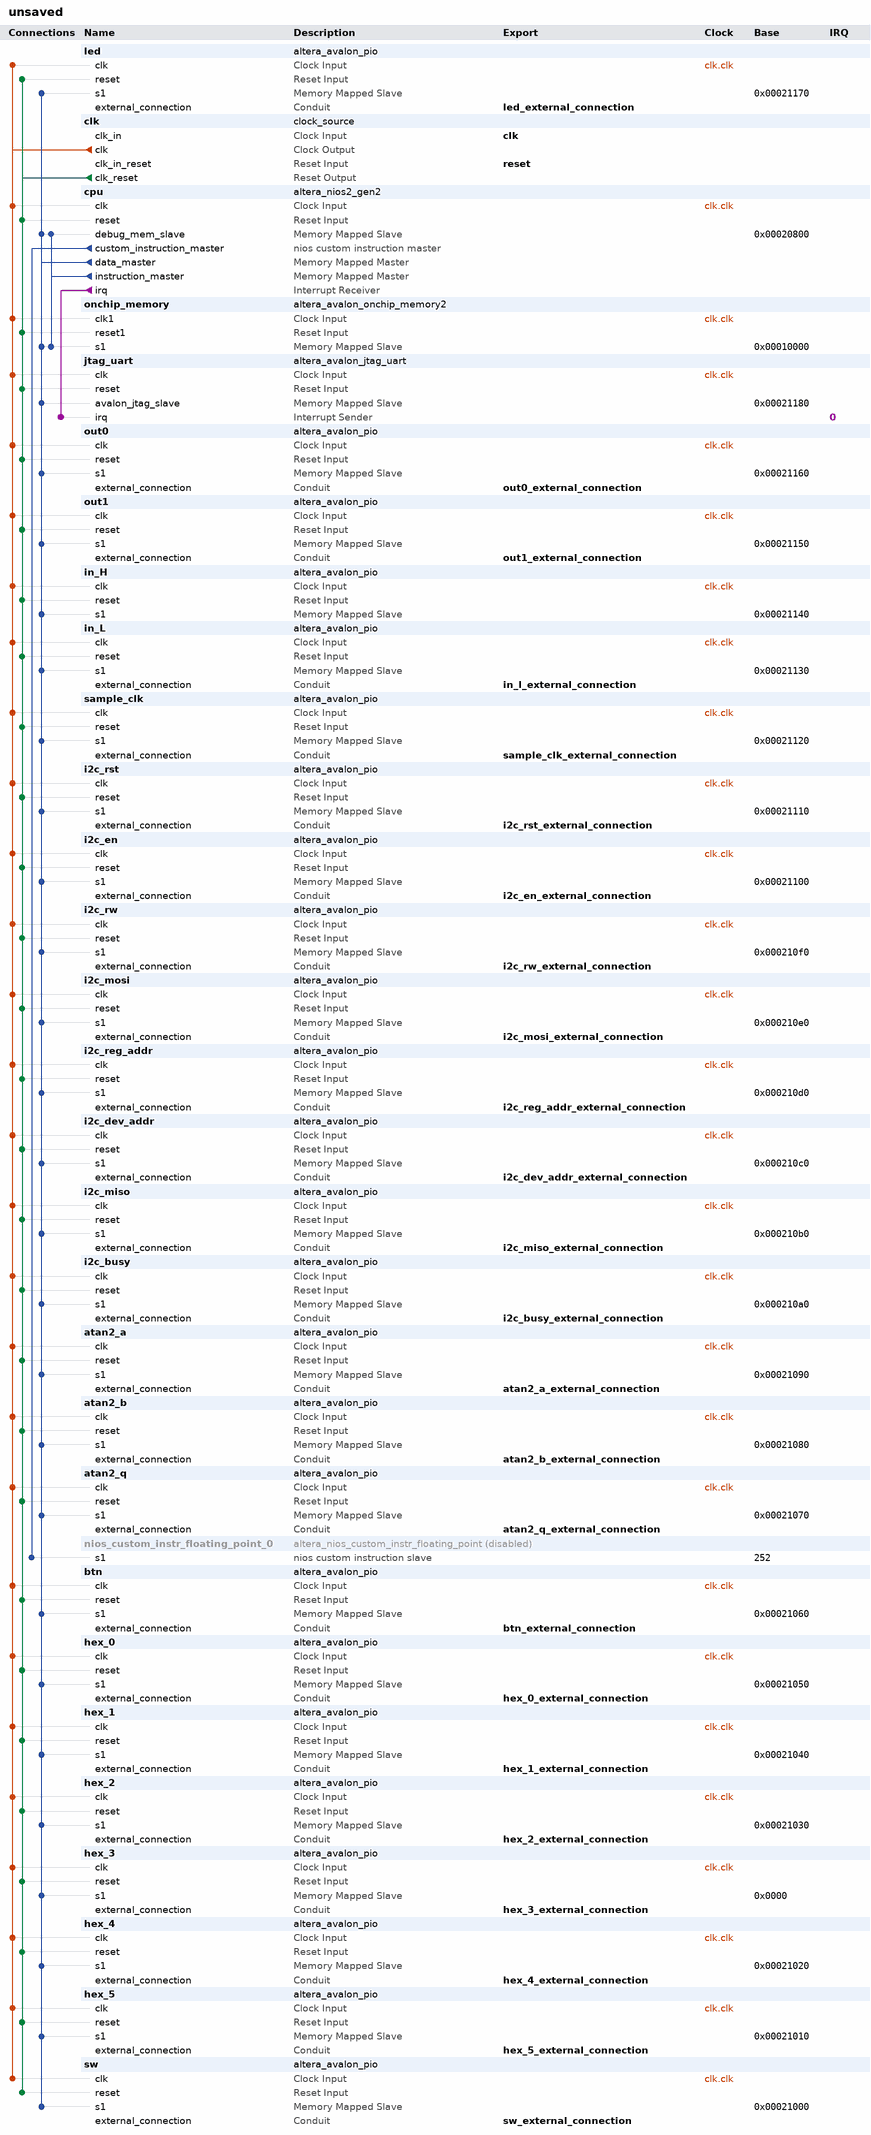
[diagram p0: system contents]
# Platform Designer (Qsys) system unsaved, MAX 10 10M50DAF484C6GES
# Parameters at their usual value, and those the tool derives, are not listed.
package require -exact qsys 18.1
create_system unsaved
set_project_property DEVICE_FAMILY {MAX 10}
set_project_property DEVICE 10M50DAF484C6GES

add_instance led altera_avalon_pio 18.1
set_instance_parameter_value led direction Output
set_instance_parameter_value led width 10

add_instance clk clock_source 18.1
set_instance_parameter_value clk clockFrequency 50000000

add_instance cpu altera_nios2_gen2 18.1
set_instance_parameter_value cpu dcache_size 2048
set_instance_parameter_value cpu dividerType srt2
set_instance_parameter_value cpu exceptionSlave onchip_memory.s1
set_instance_parameter_value cpu icache_size 4096
set_instance_parameter_value cpu impl Tiny
set_instance_parameter_value cpu mul_32_impl 3
set_instance_parameter_value cpu mul_shift_choice 1
set_instance_parameter_value cpu resetSlave onchip_memory.s1
set_instance_parameter_value cpu setting_interruptControllerType External
set_instance_parameter_value cpu setting_shadowRegisterSets 4

add_instance onchip_memory altera_avalon_onchip_memory2 18.1
set_instance_parameter_value onchip_memory dataWidth 32
set_instance_parameter_value onchip_memory dualPort false
set_instance_parameter_value onchip_memory initMemContent false
set_instance_parameter_value onchip_memory initializationFileName onchip_mem.hex
set_instance_parameter_value onchip_memory memorySize 65536

add_instance jtag_uart altera_avalon_jtag_uart 18.1
set_instance_parameter_value jtag_uart simInteractiveOptions NO_INTERACTIVE_WINDOWS

add_instance out0 altera_avalon_pio 18.1
set_instance_parameter_value out0 direction Output
set_instance_parameter_value out0 width 32

add_instance out1 altera_avalon_pio 18.1
set_instance_parameter_value out1 direction Output
set_instance_parameter_value out1 width 32

add_instance in_H altera_avalon_pio 18.1
set_instance_parameter_value in_H direction Input
set_instance_parameter_value in_H width 32

add_instance in_L altera_avalon_pio 18.1
set_instance_parameter_value in_L direction Input
set_instance_parameter_value in_L width 32

add_instance sample_clk altera_avalon_pio 18.1
set_instance_parameter_value sample_clk direction Output
set_instance_parameter_value sample_clk width 1

add_instance i2c_rst altera_avalon_pio 18.1
set_instance_parameter_value i2c_rst direction Output
set_instance_parameter_value i2c_rst width 1

add_instance i2c_en altera_avalon_pio 18.1
set_instance_parameter_value i2c_en direction Output
set_instance_parameter_value i2c_en width 1

add_instance i2c_rw altera_avalon_pio 18.1
set_instance_parameter_value i2c_rw direction Output
set_instance_parameter_value i2c_rw width 1

add_instance i2c_mosi altera_avalon_pio 18.1
set_instance_parameter_value i2c_mosi direction Output
set_instance_parameter_value i2c_mosi width 8

add_instance i2c_reg_addr altera_avalon_pio 18.1
set_instance_parameter_value i2c_reg_addr direction Output
set_instance_parameter_value i2c_reg_addr width 8

add_instance i2c_dev_addr altera_avalon_pio 18.1
set_instance_parameter_value i2c_dev_addr direction Output
set_instance_parameter_value i2c_dev_addr width 8

add_instance i2c_miso altera_avalon_pio 18.1
set_instance_parameter_value i2c_miso direction Input
set_instance_parameter_value i2c_miso width 8

add_instance i2c_busy altera_avalon_pio 18.1
set_instance_parameter_value i2c_busy direction Input
set_instance_parameter_value i2c_busy width 1

add_instance atan2_a altera_avalon_pio 18.1
set_instance_parameter_value atan2_a direction Output
set_instance_parameter_value atan2_a width 32

add_instance atan2_b altera_avalon_pio 18.1
set_instance_parameter_value atan2_b direction Output
set_instance_parameter_value atan2_b width 32

add_instance atan2_q altera_avalon_pio 18.1
set_instance_parameter_value atan2_q direction Input
set_instance_parameter_value atan2_q width 32

add_instance nios_custom_instr_floating_point_0 altera_nios_custom_instr_floating_point 18.1
set_instance_property nios_custom_instr_floating_point_0 ENABLED false

add_instance btn altera_avalon_pio 18.1
set_instance_parameter_value btn direction Input
set_instance_parameter_value btn width 2

add_instance hex_0 altera_avalon_pio 18.1
set_instance_parameter_value hex_0 direction Output
set_instance_parameter_value hex_0 width 8

add_instance hex_1 altera_avalon_pio 18.1
set_instance_parameter_value hex_1 direction Output
set_instance_parameter_value hex_1 width 8

add_instance hex_2 altera_avalon_pio 18.1
set_instance_parameter_value hex_2 direction Output
set_instance_parameter_value hex_2 width 8

add_instance hex_3 altera_avalon_pio 18.1
set_instance_parameter_value hex_3 direction Output
set_instance_parameter_value hex_3 width 8

add_instance hex_4 altera_avalon_pio 18.1
set_instance_parameter_value hex_4 direction Output
set_instance_parameter_value hex_4 width 8

add_instance hex_5 altera_avalon_pio 18.1
set_instance_parameter_value hex_5 direction Output
set_instance_parameter_value hex_5 width 8

add_instance sw altera_avalon_pio 18.1
set_instance_parameter_value sw direction Input
set_instance_parameter_value sw width 10

# connections
add_connection clk.clk atan2_a.clk clock
add_connection clk.clk atan2_b.clk clock
add_connection clk.clk atan2_q.clk clock
add_connection clk.clk btn.clk clock
add_connection clk.clk cpu.clk clock
add_connection clk.clk hex_0.clk clock
add_connection clk.clk hex_1.clk clock
add_connection clk.clk hex_2.clk clock
add_connection clk.clk hex_3.clk clock
add_connection clk.clk hex_4.clk clock
add_connection clk.clk hex_5.clk clock
add_connection clk.clk i2c_busy.clk clock
add_connection clk.clk i2c_dev_addr.clk clock
add_connection clk.clk i2c_en.clk clock
add_connection clk.clk i2c_miso.clk clock
add_connection clk.clk i2c_mosi.clk clock
add_connection clk.clk i2c_reg_addr.clk clock
add_connection clk.clk i2c_rst.clk clock
add_connection clk.clk i2c_rw.clk clock
add_connection clk.clk in_H.clk clock
add_connection clk.clk in_L.clk clock
add_connection clk.clk jtag_uart.clk clock
add_connection clk.clk led.clk clock
add_connection clk.clk onchip_memory.clk1 clock
add_connection clk.clk out0.clk clock
add_connection clk.clk out1.clk clock
add_connection clk.clk sample_clk.clk clock
add_connection clk.clk sw.clk clock
add_connection clk.clk_reset atan2_a.reset reset
add_connection clk.clk_reset atan2_b.reset reset
add_connection clk.clk_reset atan2_q.reset reset
add_connection clk.clk_reset btn.reset reset
add_connection clk.clk_reset cpu.reset reset
add_connection clk.clk_reset hex_0.reset reset
add_connection clk.clk_reset hex_1.reset reset
add_connection clk.clk_reset hex_2.reset reset
add_connection clk.clk_reset hex_3.reset reset
add_connection clk.clk_reset hex_4.reset reset
add_connection clk.clk_reset hex_5.reset reset
add_connection clk.clk_reset i2c_busy.reset reset
add_connection clk.clk_reset i2c_dev_addr.reset reset
add_connection clk.clk_reset i2c_en.reset reset
add_connection clk.clk_reset i2c_miso.reset reset
add_connection clk.clk_reset i2c_mosi.reset reset
add_connection clk.clk_reset i2c_reg_addr.reset reset
add_connection clk.clk_reset i2c_rst.reset reset
add_connection clk.clk_reset i2c_rw.reset reset
add_connection clk.clk_reset in_H.reset reset
add_connection clk.clk_reset in_L.reset reset
add_connection clk.clk_reset jtag_uart.reset reset
add_connection clk.clk_reset led.reset reset
add_connection clk.clk_reset onchip_memory.reset1 reset
add_connection clk.clk_reset out0.reset reset
add_connection clk.clk_reset out1.reset reset
add_connection clk.clk_reset sample_clk.reset reset
add_connection clk.clk_reset sw.reset reset
add_connection cpu.data_master atan2_a.s1 avalon
set_connection_parameter_value cpu.data_master/atan2_a.s1 baseAddress 0x00021090
add_connection cpu.data_master atan2_b.s1 avalon
set_connection_parameter_value cpu.data_master/atan2_b.s1 baseAddress 0x00021080
add_connection cpu.data_master atan2_q.s1 avalon
set_connection_parameter_value cpu.data_master/atan2_q.s1 baseAddress 0x00021070
add_connection cpu.data_master btn.s1 avalon
set_connection_parameter_value cpu.data_master/btn.s1 baseAddress 0x00021060
add_connection cpu.data_master cpu.debug_mem_slave avalon
set_connection_parameter_value cpu.data_master/cpu.debug_mem_slave baseAddress 0x00020800
add_connection cpu.data_master hex_0.s1 avalon
set_connection_parameter_value cpu.data_master/hex_0.s1 baseAddress 0x00021050
add_connection cpu.data_master hex_1.s1 avalon
set_connection_parameter_value cpu.data_master/hex_1.s1 baseAddress 0x00021040
add_connection cpu.data_master hex_2.s1 avalon
set_connection_parameter_value cpu.data_master/hex_2.s1 baseAddress 0x00021030
add_connection cpu.data_master hex_3.s1 avalon
set_connection_parameter_value cpu.data_master/hex_3.s1 baseAddress 0x0000
add_connection cpu.data_master hex_4.s1 avalon
set_connection_parameter_value cpu.data_master/hex_4.s1 baseAddress 0x00021020
add_connection cpu.data_master hex_5.s1 avalon
set_connection_parameter_value cpu.data_master/hex_5.s1 baseAddress 0x00021010
add_connection cpu.data_master i2c_busy.s1 avalon
set_connection_parameter_value cpu.data_master/i2c_busy.s1 baseAddress 0x000210a0
add_connection cpu.data_master i2c_dev_addr.s1 avalon
set_connection_parameter_value cpu.data_master/i2c_dev_addr.s1 baseAddress 0x000210c0
add_connection cpu.data_master i2c_en.s1 avalon
set_connection_parameter_value cpu.data_master/i2c_en.s1 baseAddress 0x00021100
add_connection cpu.data_master i2c_miso.s1 avalon
set_connection_parameter_value cpu.data_master/i2c_miso.s1 baseAddress 0x000210b0
add_connection cpu.data_master i2c_mosi.s1 avalon
set_connection_parameter_value cpu.data_master/i2c_mosi.s1 baseAddress 0x000210e0
add_connection cpu.data_master i2c_reg_addr.s1 avalon
set_connection_parameter_value cpu.data_master/i2c_reg_addr.s1 baseAddress 0x000210d0
add_connection cpu.data_master i2c_rst.s1 avalon
set_connection_parameter_value cpu.data_master/i2c_rst.s1 baseAddress 0x00021110
add_connection cpu.data_master i2c_rw.s1 avalon
set_connection_parameter_value cpu.data_master/i2c_rw.s1 baseAddress 0x000210f0
add_connection cpu.data_master in_H.s1 avalon
set_connection_parameter_value cpu.data_master/in_H.s1 baseAddress 0x00021140
add_connection cpu.data_master in_L.s1 avalon
set_connection_parameter_value cpu.data_master/in_L.s1 baseAddress 0x00021130
add_connection cpu.data_master jtag_uart.avalon_jtag_slave avalon
set_connection_parameter_value cpu.data_master/jtag_uart.avalon_jtag_slave baseAddress 0x00021180
add_connection cpu.data_master led.s1 avalon
set_connection_parameter_value cpu.data_master/led.s1 baseAddress 0x00021170
add_connection cpu.data_master onchip_memory.s1 avalon
set_connection_parameter_value cpu.data_master/onchip_memory.s1 baseAddress 0x00010000
add_connection cpu.data_master out0.s1 avalon
set_connection_parameter_value cpu.data_master/out0.s1 baseAddress 0x00021160
add_connection cpu.data_master out1.s1 avalon
set_connection_parameter_value cpu.data_master/out1.s1 baseAddress 0x00021150
add_connection cpu.data_master sample_clk.s1 avalon
set_connection_parameter_value cpu.data_master/sample_clk.s1 baseAddress 0x00021120
add_connection cpu.data_master sw.s1 avalon
set_connection_parameter_value cpu.data_master/sw.s1 baseAddress 0x00021000
add_connection cpu.instruction_master cpu.debug_mem_slave avalon
set_connection_parameter_value cpu.instruction_master/cpu.debug_mem_slave baseAddress 0x00020800
add_connection cpu.instruction_master onchip_memory.s1 avalon
set_connection_parameter_value cpu.instruction_master/onchip_memory.s1 baseAddress 0x00010000
add_connection cpu.irq jtag_uart.irq interrupt
set_connection_parameter_value cpu.irq/jtag_uart.irq irqNumber 0
add_connection cpu.custom_instruction_master nios_custom_instr_floating_point_0.s1 nios_custom_instruction
set_connection_parameter_value cpu.custom_instruction_master/nios_custom_instr_floating_point_0.s1 CIName nios_custom_instr_floating_point_0
set_connection_parameter_value cpu.custom_instruction_master/nios_custom_instr_floating_point_0.s1 baseAddress 252

# exported interfaces
add_interface atan2_a_external_connection conduit end
set_interface_property atan2_a_external_connection EXPORT_OF atan2_a.external_connection
add_interface atan2_b_external_connection conduit end
set_interface_property atan2_b_external_connection EXPORT_OF atan2_b.external_connection
add_interface atan2_q_external_connection conduit end
set_interface_property atan2_q_external_connection EXPORT_OF atan2_q.external_connection
add_interface btn_external_connection conduit end
set_interface_property btn_external_connection EXPORT_OF btn.external_connection
add_interface clk clock sink
set_interface_property clk EXPORT_OF clk.clk_in
add_interface hex_0_external_connection conduit end
set_interface_property hex_0_external_connection EXPORT_OF hex_0.external_connection
add_interface hex_1_external_connection conduit end
set_interface_property hex_1_external_connection EXPORT_OF hex_1.external_connection
add_interface hex_2_external_connection conduit end
set_interface_property hex_2_external_connection EXPORT_OF hex_2.external_connection
add_interface hex_3_external_connection conduit end
set_interface_property hex_3_external_connection EXPORT_OF hex_3.external_connection
add_interface hex_4_external_connection conduit end
set_interface_property hex_4_external_connection EXPORT_OF hex_4.external_connection
add_interface hex_5_external_connection conduit end
set_interface_property hex_5_external_connection EXPORT_OF hex_5.external_connection
add_interface i2c_busy_external_connection conduit end
set_interface_property i2c_busy_external_connection EXPORT_OF i2c_busy.external_connection
add_interface i2c_dev_addr_external_connection conduit end
set_interface_property i2c_dev_addr_external_connection EXPORT_OF i2c_dev_addr.external_connection
add_interface i2c_en_external_connection conduit end
set_interface_property i2c_en_external_connection EXPORT_OF i2c_en.external_connection
add_interface i2c_miso_external_connection conduit end
set_interface_property i2c_miso_external_connection EXPORT_OF i2c_miso.external_connection
add_interface i2c_mosi_external_connection conduit end
set_interface_property i2c_mosi_external_connection EXPORT_OF i2c_mosi.external_connection
add_interface i2c_reg_addr_external_connection conduit end
set_interface_property i2c_reg_addr_external_connection EXPORT_OF i2c_reg_addr.external_connection
add_interface i2c_rst_external_connection conduit end
set_interface_property i2c_rst_external_connection EXPORT_OF i2c_rst.external_connection
add_interface i2c_rw_external_connection conduit end
set_interface_property i2c_rw_external_connection EXPORT_OF i2c_rw.external_connection
add_interface in_l_external_connection conduit end
set_interface_property in_l_external_connection EXPORT_OF in_L.external_connection
add_interface led_external_connection conduit end
set_interface_property led_external_connection EXPORT_OF led.external_connection
add_interface out0_external_connection conduit end
set_interface_property out0_external_connection EXPORT_OF out0.external_connection
add_interface out1_external_connection conduit end
set_interface_property out1_external_connection EXPORT_OF out1.external_connection
add_interface reset reset sink
set_interface_property reset EXPORT_OF clk.clk_in_reset
add_interface sample_clk_external_connection conduit end
set_interface_property sample_clk_external_connection EXPORT_OF sample_clk.external_connection
add_interface sw_external_connection conduit end
set_interface_property sw_external_connection EXPORT_OF sw.external_connection

set_interconnect_requirement {$system} qsys_mm.clockCrossingAdapter HANDSHAKE
set_interconnect_requirement {$system} qsys_mm.enableEccProtection FALSE
set_interconnect_requirement {$system} qsys_mm.insertDefaultSlave FALSE
set_interconnect_requirement {$system} qsys_mm.maxAdditionalLatency 1

save_system unsaved.qsys
